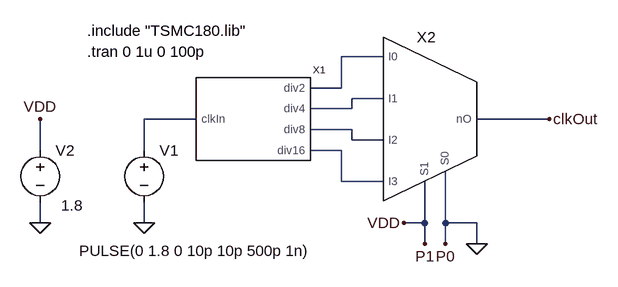
[diagram p0: schematic freq_divider_power_2_test.asc]
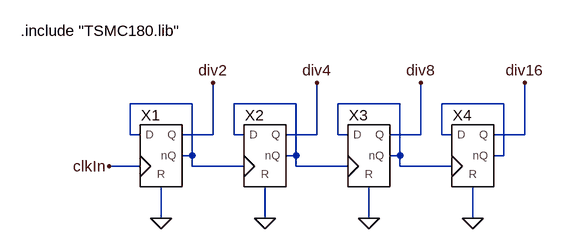
[diagram p1: sub-circuit freq_divider_power_2.asc]
freq_divider_power_2_test.asc, the LTspice schematic file:
Version 4
SHEET 1 2200 1356
WIRE 1264 112 1200 112
WIRE 1200 160 1200 112
WIRE 1200 160 1152 160
WIRE 1264 176 1216 176
WIRE 1216 192 1216 176
WIRE 1216 192 1152 192
WIRE 976 208 896 208
WIRE 1520 208 1408 208
WIRE 1216 224 1152 224
WIRE 1216 240 1216 224
WIRE 1264 240 1216 240
WIRE 736 256 736 208
WIRE 896 256 896 208
WIRE 1200 256 1152 256
WIRE 1200 304 1200 256
WIRE 1264 304 1200 304
WIRE 736 368 736 336
WIRE 896 368 896 336
WIRE 1328 368 1328 304
WIRE 1328 368 1296 368
WIRE 1360 368 1360 288
WIRE 1408 368 1360 368
WIRE 1328 400 1328 368
WIRE 1360 400 1360 368
WIRE 1408 400 1408 368
FLAG 896 368 0
FLAG 1328 400 P1
FLAG 1360 400 P0
FLAG 1408 400 0
FLAG 1296 368 VDD
FLAG 736 368 0
FLAG 736 208 VDD
FLAG 1520 208 clkOut
SYMBOL voltage 896 240 R0
WINDOW 3 -100 171 Left 2
WINDOW 123 0 0 Left 0
WINDOW 39 0 0 Left 0
SYMATTR Value PULSE(0 1.8 0 10p 10p 500p 1n)
SYMATTR InstName V1
SYMBOL freq_divider_power_2 1024 176 R0
SYMATTR InstName X1
SYMBOL inverting_mux_4 1312 176 R0
SYMATTR InstName X2
SYMBOL voltage 736 240 R0
WINDOW 3 32 101 Left 2
WINDOW 123 0 0 Left 0
WINDOW 39 0 0 Left 0
SYMATTR Value 1.8
SYMATTR InstName V2
TEXT 808 72 Left 2 !.include "TSMC180.lib"
TEXT 808 104 Left 2 !.tran 0 1u 0 100p

freq_divider_power_2.asc, the sub-circuit schematic file:
Version 4
SHEET 1 2200 680
WIRE 1056 208 960 208
WIRE 1216 208 1120 208
WIRE 1376 208 1280 208
WIRE 1536 208 1440 208
WIRE 960 256 960 208
WIRE 976 256 960 256
WIRE 1088 256 1088 176
WIRE 1088 256 1040 256
WIRE 1120 256 1120 208
WIRE 1136 256 1120 256
WIRE 1248 256 1248 176
WIRE 1248 256 1200 256
WIRE 1280 256 1280 208
WIRE 1296 256 1280 256
WIRE 1408 256 1408 176
WIRE 1408 256 1360 256
WIRE 1440 256 1440 208
WIRE 1456 256 1440 256
WIRE 1568 256 1568 176
WIRE 1568 256 1520 256
WIRE 1056 288 1056 208
WIRE 1056 288 1040 288
WIRE 1216 288 1216 208
WIRE 1216 288 1200 288
WIRE 1376 288 1376 208
WIRE 1376 288 1360 288
WIRE 1536 288 1536 208
WIRE 1536 288 1520 288
WIRE 976 304 928 304
WIRE 1056 304 1056 288
WIRE 1136 304 1056 304
WIRE 1216 304 1216 288
WIRE 1296 304 1216 304
WIRE 1376 304 1376 288
WIRE 1456 304 1376 304
WIRE 1008 384 1008 336
WIRE 1168 384 1168 336
WIRE 1328 384 1328 336
WIRE 1488 384 1488 336
FLAG 928 304 clkIn
FLAG 1008 384 0
FLAG 1168 384 0
FLAG 1328 384 0
FLAG 1488 384 0
FLAG 1088 176 div2
FLAG 1248 176 div4
FLAG 1408 176 div8
FLAG 1568 176 div16
SYMBOL ffd_arst 1008 288 R0
SYMATTR InstName X1
SYMATTR SpiceLine VDD={VDD} L={L} LD={LD} WN={WN} WPFACT=1.5
SYMBOL ffd_arst 1168 288 R0
SYMATTR InstName X2
SYMATTR SpiceLine VDD={VDD} L={L} LD={LD} WN={WN} WPFACT=1.5
SYMBOL ffd_arst 1328 288 R0
SYMATTR InstName X3
SYMATTR SpiceLine VDD={VDD} L={L} LD={LD} WN={WN} WPFACT=1.5
SYMBOL ffd_arst 1488 288 R0
SYMATTR InstName X4
SYMATTR SpiceLine VDD={VDD} L={L} LD={LD} WN={WN} WPFACT=1.5
TEXT 792 96 Left 2 !.include "TSMC180.lib"

The netlist it stands for:
* freq_divider_power_2_test.asc
V1 N003 0 PULSE(0 1.8 0 10p 10p 500p 1n)
XX1 N003 N001 N002 N004 N005 freq_divider_power_2 params: VDD=1.8 L=0.18u LD=0.48u WN=0.42u WPFACT=1.5
XX2 N001 N002 N004 N005 VDD 0 clkOut inverting_mux_4 VDD=1.8 L=0.18u LD=0.48u WN=0.42u WPFACT=1.5  ; pins I0 I1 I2 I3 S1 S0 nO
V2 VDD 0 1.8

* block symbol definitions
.subckt freq_divider_power_2 clkIn div2 div4 div8 div16
XX1 N001 div2 clkIn 0 N001 ffd_arst VDD={VDD} L={L} LD={LD} WN={WN} WPFACT=1.5  ; pins D Q CLK R nQ
XX2 N002 div4 N001 0 N002 ffd_arst VDD={VDD} L={L} LD={LD} WN={WN} WPFACT=1.5  ; pins D Q CLK R nQ
XX3 N003 div8 N002 0 N003 ffd_arst VDD={VDD} L={L} LD={LD} WN={WN} WPFACT=1.5  ; pins D Q CLK R nQ
XX4 N004 div16 N003 0 N004 ffd_arst VDD={VDD} L={L} LD={LD} WN={WN} WPFACT=1.5  ; pins D Q CLK R nQ
.include "TSMC180.lib"
.ends freq_divider_power_2

.include "TSMC180.lib"
.tran 0 1u 0 100p
.backanno
.end